# EAGLE design main (EAGLE 9.3.1)
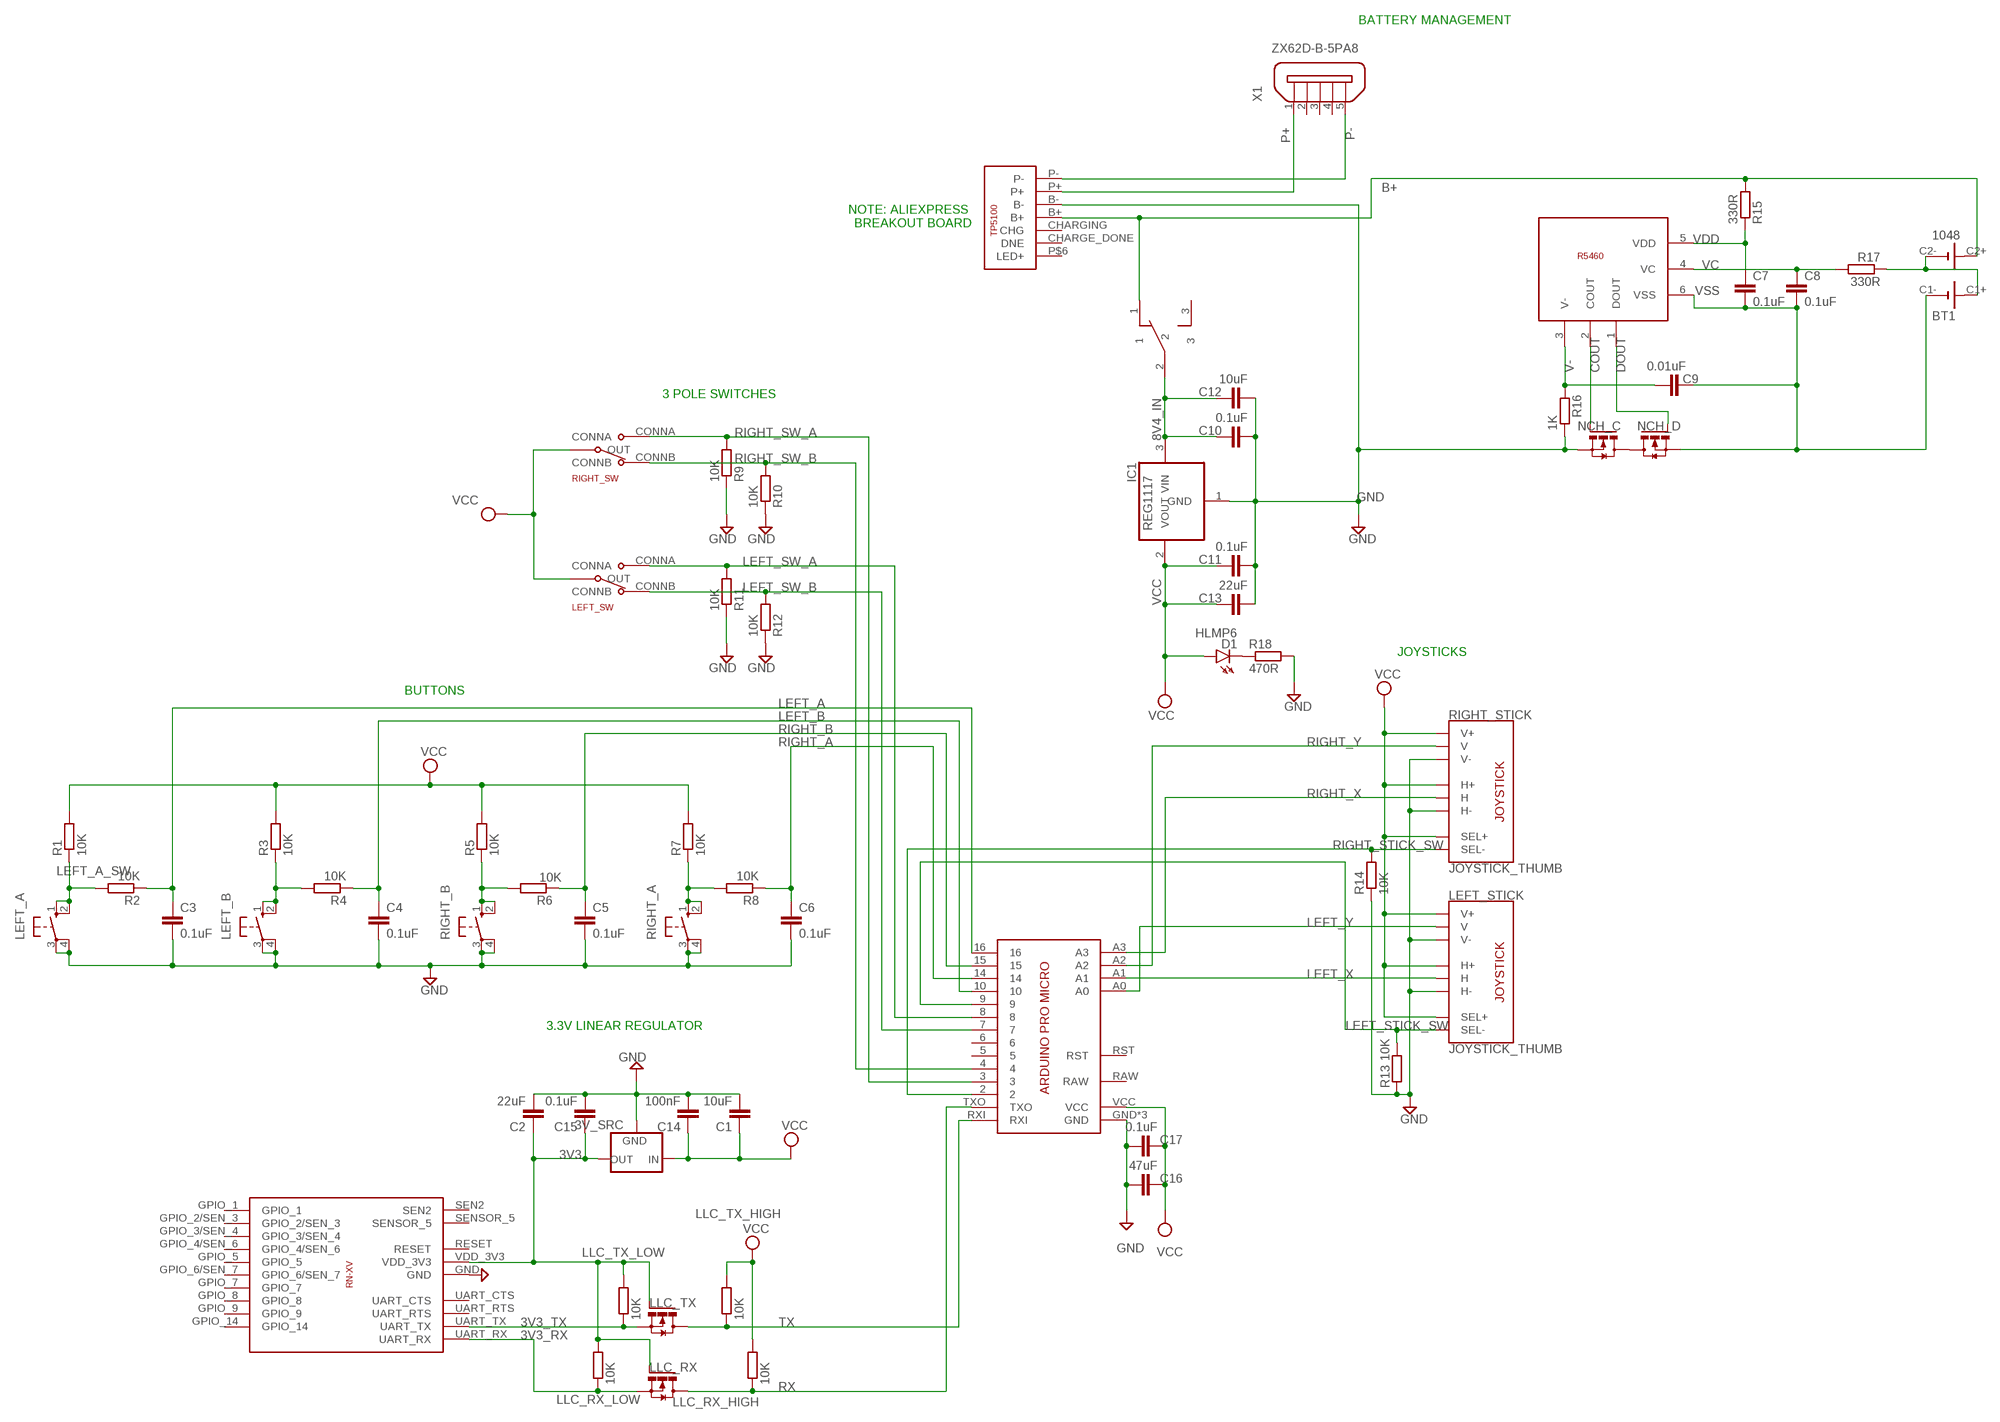
[diagram p0: schematic, sheet 1]

## Parts
3V_SRC  V_REG_LD1117VXXLD1117-SMD  [SOT223]
BT1  1048  [BAT_1048]
C1  10uF  C-EUC0805  [C0805]
C2  22uF  C-EUC0805  [C0805]
C3  0.1uF  0.1UF-0603-25V-5%  [0603]
C4  0.1uF  0.1UF-0603-25V-5%  [0603]
C5  0.1uF  0.1UF-0603-25V-5%  [0603]
C6  0.1uF  0.1UF-0603-25V-5%  [0603]
C7  0.1uF  0.1UF-0603-25V-(+80/-20%)  [0603]
C8  0.1uF  0.1UF-0603-25V-(+80/-20%)  [0603]
C9  0.01uF  0.1UF-0603-25V-(+80/-20%)  [0603]
C10  0.1uF  C-EUC0805  [C0805]
C11  0.1uF  C-EUC0805  [C0805]
C12  10uF  C-EUC0805  [C0805]
C13  22uF  C-EUC0805  [C0805]
C14  100nF  C-EUC0805  [C0805]
C15  0.1uF  C-EUC0805  [C0805]
C16  47uF  C-EUC0805  [C0805]
C17  0.1uF  C-EUC0805  [C0805]
D1  HLMP6  [HLMP6]
IC1  REG1117  [SOT223]
LEFT_A  10-XX  [B3F-10XX]
LEFT_B  10-XX  [B3F-10XX]
LEFT_STICK  JOYSTICK_THUMB  [JOYSTICK]
LEFT_SW  2_POLE_SWITCH  [2_POLE_SWITCH]
LLC_RX  2N7002,215  [SOT23-3]
LLC_RX_HIGH  10K  R  [R0805]
LLC_RX_LOW  10K  R  [R0805]
LLC_TX  2N7002,215  [SOT23-3]
LLC_TX_HIGH  10K  R  [R0805]
LLC_TX_LOW  10K  R  [R0805]
NCH_C  FQD13N06LTM  [DPAK4]
NCH_D  FQD13N06LTM  [DPAK4]
R1  10K  R  [R0805]
R2  10K  R  [R0805]
R3  10K  R  [R0805]
R4  10K  R  [R0805]
R5  10K  R  [R0805]
R6  10K  R  [R0805]
R7  10K  R  [R0805]
R8  10K  R  [R0805]
R9  10K  R  [R0805]
R10  10K  R  [R0805]
R11  10K  R  [R0805]
R12  10K  R  [R0805]
R13  10K  R  [R0805]
R14  10K  R  [R0805]
R15  330R  R  [R0805]
R16  1K  R  [R0805]
R17  330R  R  [R0805]
R18  470R  R  [R0805]
R5460  R5460  [SOT-23-6]
RIGHT_A  10-XX  [B3F-10XX]
RIGHT_B  10-XX  [B3F-10XX]
RIGHT_STICK  JOYSTICK_THUMB  [JOYSTICK]
RIGHT_SW  2_POLE_SWITCH  [2_POLE_SWITCH]
U$1  ARDUINO_PRO_MICRO  [ARDUINO_PRO_MICRO]
U$2  RN-XV  [RN-XV]
U$4  TP5100_MODULE  [TP5100_MODULE]
U$6  EG1201  [EG1201]
X1  ZX62D-B-5PA8  [ZX62D-B-5PA8]

## Nets
3V3: 3V_SRC.2(OUT) C2.1 C15.1 LLC_RX.1(G) LLC_RX_LOW.2 LLC_TX.1(G) LLC_TX_LOW.2 U$2.VDD_3V3
3V3_RX: LLC_RX.2(S) LLC_RX_LOW.1 U$2.UART_RX
3V3_TX: LLC_TX.2(S) LLC_TX_LOW.1 U$2.UART_TX
8V4_IN: C10.1 C12.1 IC1.3(VIN) U$6.2
B+: BT1.C2+ R15.2 U$4.B+ U$6.1
BM: BT1.C1+ BT1.C2- R17.1
COUT: NCH_C.1(G) R5460.2(COUT)
DOUT: NCH_D.1(G) R5460.1(DOUT)
GND: 3V_SRC.1(GND) C1.2 C2.2 C3.2 C4.2 C5.2 C6.2 C10.2 C11.2 C12.2 C13.2 C14.2 C15.2 C16.2 C17.2 IC1.1(GND) LEFT_A.3(P) LEFT_A.4(P1) LEFT_B.3(P) LEFT_B.4(P1) LEFT_STICK.H3(H-) LEFT_STICK.V3(V-) NCH_C.3(S) R9.1 R10.1 R11.1 R12.1 R13.1 R14.1 R16.1 R18.2 RIGHT_A.3(P) RIGHT_A.4(P1) RIGHT_B.3(P) RIGHT_B.4(P1) RIGHT_STICK.H3(H-) RIGHT_STICK.V3(V-) U$1.GND U$1.GND2(GND) U$1.GND3(GND) U$2.GND U$4.B-
LEFT_A: C3.1 R2.1 U$1.16
LEFT_A_SW: LEFT_A.1(S) LEFT_A.2(S1) R1.1 R2.2
LEFT_B: C4.1 R4.1 U$1.10
LEFT_B_SW: LEFT_B.1(S) LEFT_B.2(S1) R3.1 R4.2
LEFT_STICK_SW: LEFT_STICK.B2A(SEL-) R13.2 U$1.9
LEFT_SW_A: LEFT_SW.CONNA R11.2 U$1.8
LEFT_SW_B: LEFT_SW.CONNB R12.2 U$1.7
LEFT_X: LEFT_STICK.H2(H) U$1.A1
LEFT_Y: LEFT_STICK.V2(V) U$1.A0
N$3: NCH_C.2(D) NCH_C.4(D) NCH_D.2(D) NCH_D.4(D)
N$5: D1.K R18.1
P+: U$4.P+ X1.1
P-: U$4.P- X1.5
RIGHT_A: C6.1 R8.1 U$1.14
RIGHT_A_SW: R7.1 R8.2 RIGHT_A.1(S) RIGHT_A.2(S1)
RIGHT_B: C5.1 R6.1 U$1.15
RIGHT_B_SW: R5.1 R6.2 RIGHT_B.1(S) RIGHT_B.2(S1)
RIGHT_STICK_SW: R14.2 RIGHT_STICK.B2A(SEL-) U$1.2
RIGHT_SW_A: R9.2 RIGHT_SW.CONNA U$1.3
RIGHT_SW_B: R10.2 RIGHT_SW.CONNB U$1.4
RIGHT_X: RIGHT_STICK.H2(H) U$1.A3
RIGHT_Y: RIGHT_STICK.V2(V) U$1.A2
RX: LLC_RX.3(D) LLC_RX_HIGH.1 U$1.TXO
TX: LLC_TX.3(D) LLC_TX_HIGH.1 U$1.RXI
V-: C9.1 R16.2 R5460.3(V-)
VC: C8.1 R17.2 R5460.4(VC)
VCC: 3V_SRC.3(IN) C1.1 C11.1 C13.1 C14.1 C16.1 C17.1 D1.A IC1.2(VOUT) LEFT_STICK.B1A(SEL+) LEFT_STICK.H1(H+) LEFT_STICK.V1(V+) LEFT_SW.OUT LLC_RX_HIGH.2 LLC_TX_HIGH.2 R1.2 R3.2 R5.2 R7.2 RIGHT_STICK.B1A(SEL+) RIGHT_STICK.H1(H+) RIGHT_STICK.V1(V+) RIGHT_SW.OUT U$1.VCC
VDD: C7.1 R15.1 R5460.5(VDD)
VSS: BT1.C1- C7.2 C8.2 C9.2 NCH_D.3(S) R5460.6(VSS)
Unconnected: U$1.5 U$1.6 U$1.RAW U$1.RST U$2.GPIO_1 U$2.GPIO_2/SEN_3 U$2.GPIO_3/SEN_4 U$2.GPIO_4/SEN_6 U$2.GPIO_5 U$2.GPIO_6/SEN_7 U$2.GPIO_7 U$2.GPIO_8 U$2.GPIO_9 U$2.GPIO_14 U$2.RESET U$2.SEN2 U$2.SENSOR_5 U$2.UART_CTS U$2.UART_RTS U$4.CHARGE_DONE(DNE) U$4.CHARGING(CHG) U$4.P$6(LED+) U$6.3 X1.2 X1.3 X1.4 X1.S1 X1.S2 X1.S3 X1.S4

## Notes on the sheet
- BATTERY MANAGEMENT
- NOTE: ALIEXPRESS 
  BREAKOUT BOARD
- 3 POLE SWITCHES
- JOYSTICKS
- BUTTONS
- 3.3V LINEAR REGULATOR

## Library data of the parts
3V_SRC = CUSTOM-SparkFun-IC-Power:V_REG_LD1117VXX: LD1117VXX voltage regulator. We carry the 3.3V version (COM-00526) in TO-220 package.; PROD_ID: VREG-13917
BT1 = 1048:1048: Lithium-Ion Battery Holder, 2 Cell, Plastic UL 94V-O, SMT; AVAILABILITY: Unavailable; DESCRIPTION: Grip, Pump Handle; MF: Adafruit Industries; MP: 1048; PACKAGE: None; PRICE: None
C1 C2 C10-C17 = rcl:C-EU: CAPACITOR, European symbol; SPICEPREFIX: C
C3-C6 = SparkFun-Capacitors:0.1UF: 0.1µF ceramic capacitors A capacitor is a passive two-terminal electrical component used to store electrical energy temporarily in an electric field.; PROD_ID: CAP-08604
C7 C8 = SparkFun-Capacitors:0.1UF: 0.1µF ceramic capacitors A capacitor is a passive two-terminal electrical component used to store electrical energy temporarily in an electric field.; PROD_ID: CAP-00810
C9 = SparkFun-Capacitors:0.1UF: 0.1µF ceramic capacitors A capacitor is a passive two-terminal electrical component used to store electrical energy temporarily in an electric field.; PROD_ID: CAP-00810; VALUE: 0.1uF
D1 = display-hp:HLMP6: LED 2mm horizontal; MF: AGILENT TECHNOLOGIES; MPN: HLMP-6500; OC_FARNELL: 1652490; OC_NEWARK: 40K0088
IC1 = burr-brown:REG1117: 800mA and 1A Low Dropout (LDO) Positive Regulator 1.8V, 2.5V, 2.85V, 3.3V, 5V, and Adj; MPN: REG1117; OC_FARNELL: 1097566; OC_NEWARK: 14P6981
LEFT_A LEFT_B RIGHT_A RIGHT_B = switch-omron:10-XX: OMRON SWITCH; MPN: B3F-1000; OC_FARNELL: 176432; OC_NEWARK: 36M3542
LEFT_STICK RIGHT_STICK = SparkFun-Switches:JOYSTICK_THUMB: Analog Thumb Joystick This is a joystick very similar to the ‘analog’ joysticks on PS2 (PlayStation 2) controllers. Directional movements are simply two potentiometers - one for each axis. Pots are ~10k each. This joystick also has a select button that is actuated when the joystick is pressed down. SparkFun Products Thumb Joystick <https://www.sparkfun.com/products/9032> (COM-09032) SparkFun Thumb Joystick Breakout <https://www.sparkfun.com/products/9110> (BOB-09110) SparkFun Joystick Shield Kit <https://www.sparkfun.com/products/9760> (DEV-09760); PROD_ID: COMP-09744; SF_SKU: COM-09032
LEFT_SW RIGHT_SW = CustomParts:2_POLE_SWITCH
LLC_RX LLC_TX = Transistor:2N7002,215: MOSFET N-CH 60V 300MA SOT-23 Manufacturer's datasheet <https://assets.nexperia.com/documents/data-sheet/2N7002.pdf>; CREATED_BY: PCBLayout.com; DIGIKEY_PART_NUMBER: 1727-2764-1-ND; MANUFACTURER: Nexperia USA Inc.; MPN: 2N7002,215; PACKAGE: SOT-23-3
LLC_RX_HIGH LLC_RX_LOW LLC_TX_HIGH LLC_TX_LOW R1-R18 = eagle-ltspice:R: RESISTOR, European symbol; SPICEMODEL: NONE; SPICEPREFIX: R
NCH_C NCH_D = Transistor:FQD13N06LTM: MOSFET N-CH 60V 11A DPAK Manufacturer's datasheet <https://www.onsemi.com/pub/Collateral/FQU13N06L-D.PDF>; CREATED_BY: PCBLayout.com; DIGIKEY_PART_NUMBER: FQD13N06LTMCT-ND; MANUFACTURER: ON Semiconductor; MPN: FQD13N06LTM; PACKAGE: DPAK-4
R5460 = CustomParts:R5460
U$1 = arduino:ARDUINO_PRO_MICRO: Arduino Pro Micro Pin headers for Arduino Pro Micro board from SparkFun
U$2 = CustomParts:RN-XV
U$4 = CustomParts:TP5100_MODULE
U$6 = CustomParts:EG1201
X1 = zx62d-b-5pa8-oshpark_10:ZX62D-B-5PA8: Micro USB Type B Connector - Standard, Shell Through Hole Source: http://www.hirose.co.jp/cataloge_hp/ed_ZX_20140804.pdf; MF: Hirose; MPN: ZX62D-B-5PA8; OC_FARNELL: 2300438; OC_NEWARK: 69W0712

## Board
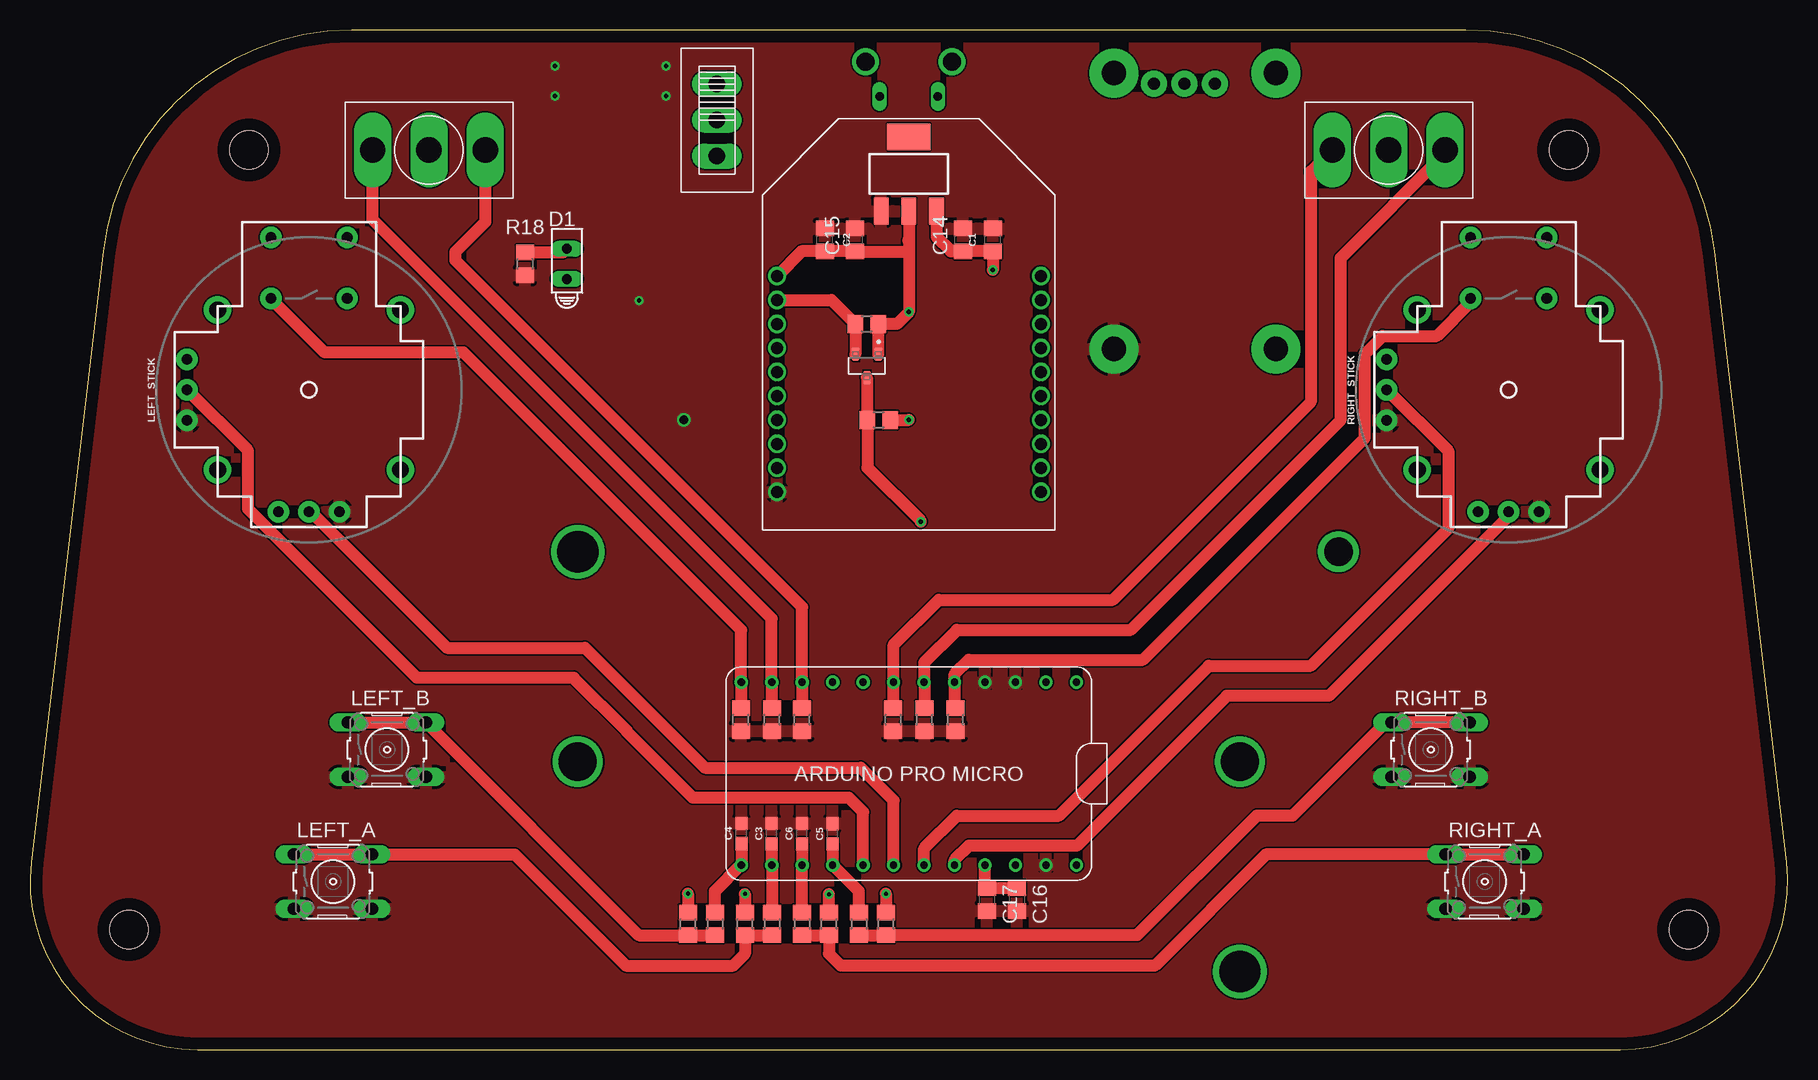
[diagram p1: board, top side]
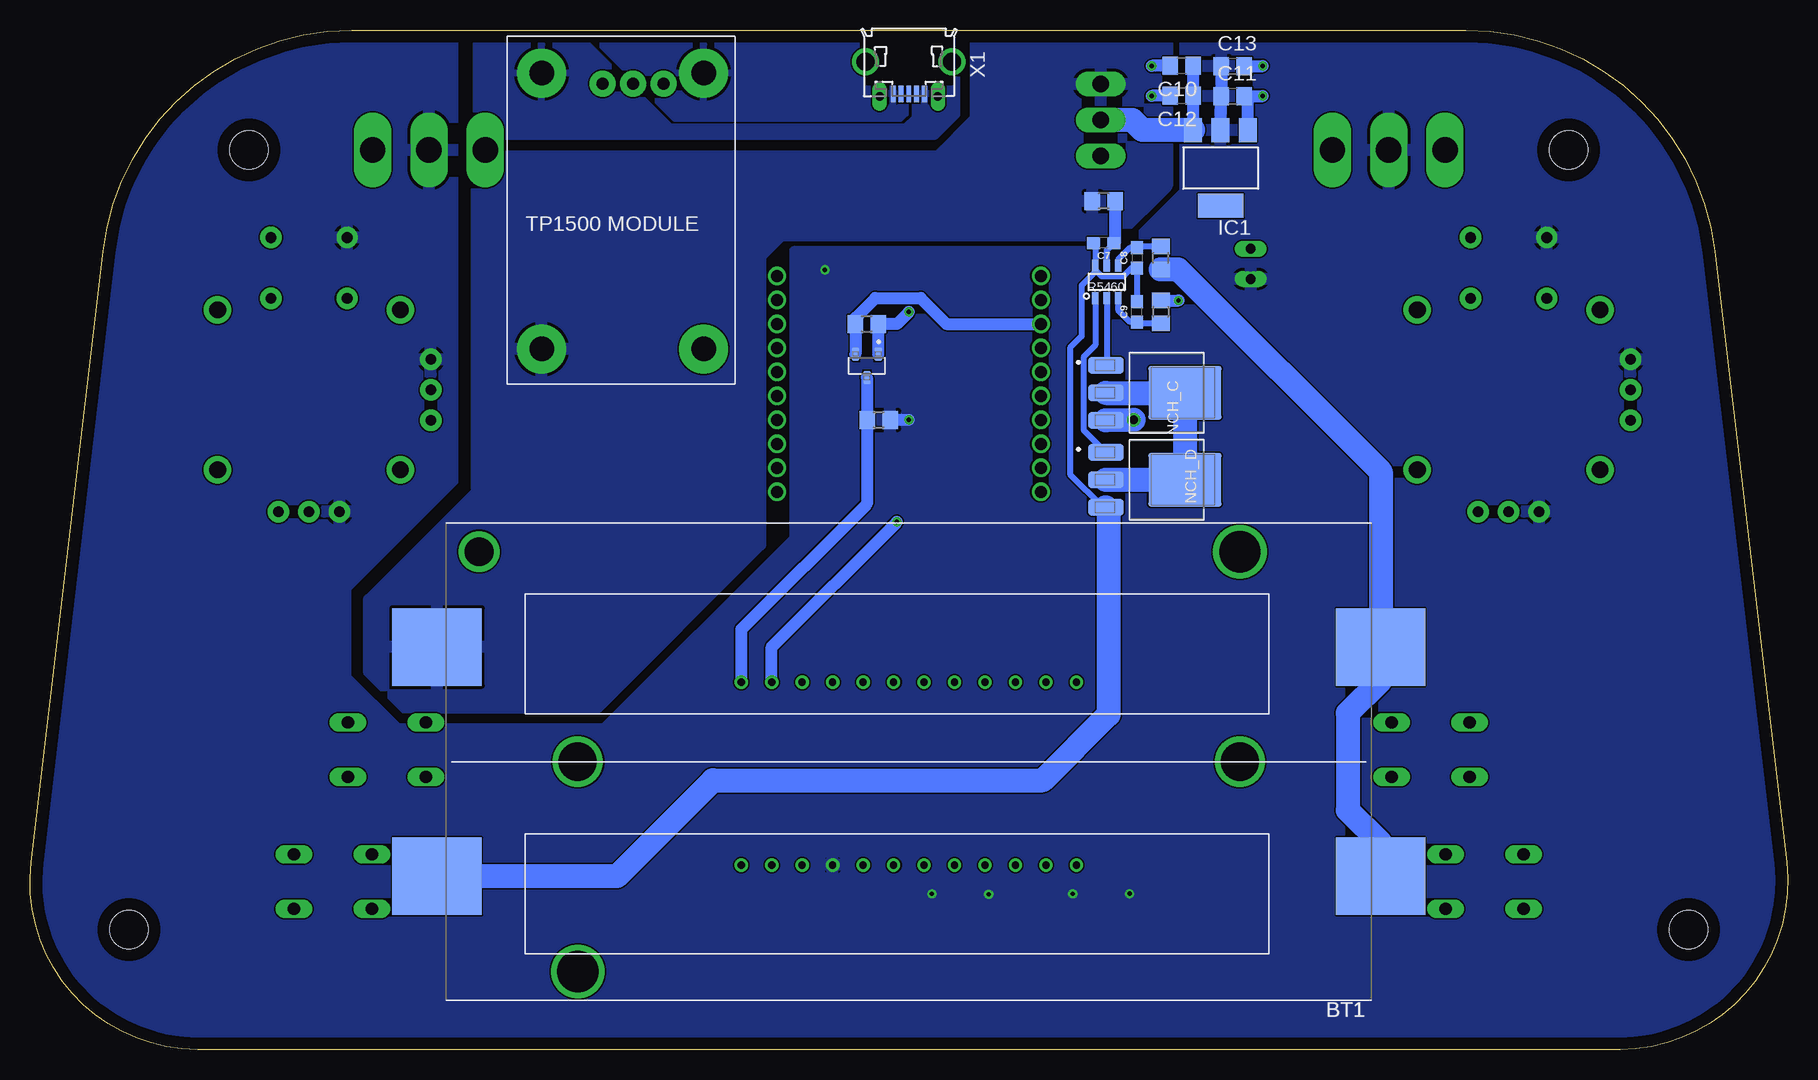
[diagram p2: board, bottom side, seen from below]

Size 146.51 x 85 mm. Coordinates in mm from the lower left corner, seen from the top.
Outline: 13.97,0 132.55,0 arc97 146.42,15.6 140.42,66.58 arc83 119.71,85 26.81,85 arc83 6.09,66.58 0.09,15.6 arc97 13.97,0
Copper layers (1*16): Top 0.035mm / dielectric 1.5mm / Bottom 0.035mm
Design rules "jlc": minimum track width 5mil, minimum drill 0.3mm, track to track 5mil, track to pad 5mil, pad to pad 5mil, via to via 5mil, smd to smd 5mil, copper to edge 40mil, drill to drill 0.25mm, minimum pad ring 10mil, minimum via ring 8mil, stop-mask expansion 4mil, vias tented up to drill 0mil, thermal gap 10mil
Holes 3.2 mm at 8.26,10 138.26,10 128.26,75 18.26,75

### Footprints (pad centres in the part's own frame; a part is rotated, then mirrored left to right if it is on the bottom)
SOT223 = smd 1.219 x 2.235: 1 -2.311,-3.099; 2 0,-3.099; 3 2.311,-3.099 | smd 3.6 x 2.2: 4 0,3.099
BAT_1048 = smd 7.45 x 6.45: C1+ -39.33,9.555; C1- 39.33,9.555; C2+ 39.33,-9.555; C2- -39.33,-9.555 | drill 3.17: P$1 27.6,0; P$2 -27.6,0 | drill 3.45: P$3 -27.6,-17.505; P$4 27.6,17.505 | drill 2.39: P$5 35.82,-17.505
C0805 = smd 1.3 x 1.5: 1 -0.95,0; 2 0.95,0
0603 = smd 1.1 x 1: 1 -0.85,0; 2 0.85,0
HLMP6 = drill 0.813 long: A -1.27,0; K 1.27,0
SOT223' = smd 1.499 x 2.007: 1 -2.261,-3.15; 2 0.025,-3.15; 3 2.311,-3.15 | smd 3.81 x 2.007: 4 0,3.15
B3F-10XX = drill 1.016 long: 1 -3.251,2.261; 2 3.251,2.261; 3 -3.251,-2.261; 4 3.251,-2.261
JOYSTICK = drill 0.9 pad 1.778: B1A -3.175,12.7; B1B 3.175,12.7; B2A -3.175,7.62; B2B 3.175,7.62 | drill 0.889 pad 1.778: H1 -2.54,-10.16; H2 0,-10.16; H3 2.54,-10.16; V1 -10.16,2.54; V2 -10.16,0; V3 -10.16,-2.54 | drill 1.397 pad 2.286: MOUNT1 -7.62,6.668; MOUNT2 -7.62,-6.668; MOUNT3 7.62,-6.668; MOUNT4 7.62,6.668
2_POLE_SWITCH = drill 2.1 pad 2.8 long: CONNA 0,-4.7; CONNB 0,4.7; OUT 0,0
SOT23-3 = smd 0.62 x 1.1: 1 -0.95,-0.975; 2 0.95,-0.975; 3 0,0.975
R0805 = smd 1.3 x 1.5: 1 -0.95,0; 2 0.95,0
DPAK4 = smd 1.36 x 2.98: 1 -2.29,-4.07; 2 0,-4.07; 3 2.29,-4.07 | smd 4.49 x 6.1: 4 0,2.51
SOT-23-6 = smd 1 x 0.55: 1 -1.35,0.95; 2 -1.35,0; 3 -1.35,-0.95; 4 1.35,-0.95; 5 1.35,0; 6 1.35,0.95
ARDUINO_PRO_MICRO = drill 0.6: 2 -7.62,3.81; 3 -7.62,1.27; 4 -7.62,-1.27; 5 -7.62,-3.81; 6 -7.62,-6.35; 7 -7.62,-8.89; 8 -7.62,-11.43; 9 -7.62,-13.97; 10 7.62,-13.97; 14 7.62,-8.89; 15 7.62,-6.35; 16 7.62,-11.43; A0 7.62,-3.81; A1 7.62,-1.27; A2 7.62,1.27; A3 7.62,3.81; GND -7.62,8.89; GND2 -7.62,6.35; GND3 7.62,11.43; RAW 7.62,13.97; RST 7.62,8.89; RXI -7.62,11.43; TXO -7.62,13.97; VCC 7.62,6.35
RN-XV = drill 1: GND -9,10.998; GPIO_1 -7,10.998; GPIO_2/SEN_3 7,-10.998; GPIO_3/SEN_4 5,-10.998; GPIO_4/SEN_6 -5,-10.998; GPIO_5 -1,10.998; GPIO_6/SEN_7 -1,-10.998; GPIO_7 -3,10.998; GPIO_8 3,10.998; GPIO_9 -5,10.998; GPIO_14 -9,-10.998; NC -3,-10.998; RESET 1,10.998; SEN2 9,-10.998; SENSOR_5 3,-10.998; UART_CTS 1,-10.998; UART_RTS -7,-10.998; UART_RX 5,10.998; UART_TX 7,10.998; VDD_3V3 9,10.998
TP5100_MODULE = drill 2.032 pad 4.064: B+ 7.101,11.098; B- -6.399,11.098; P+ 7.101,-11.902; P- -6.399,-11.902 | drill 1.016 pad 2.184: CHARGE_DONE 2.021,-11.012; CHARGING -3.059,-11.012; P$6 -0.519,-11.012
EG1201 = drill 1.4 long: 1 -3,0; 2 0,0; 3 3,0
ZX62D-B-5PA8 = smd 1.35 x 0.4: 1 4.825,1.3; 2 4.825,0.65; 3 4.825,0; 4 4.825,-0.65; 5 4.825,-1.3 | drill 1.5: S1 2.15,-3.6; S2 2.15,3.6 | drill 0.7 long: S3 5.05,2.425; S4 5.05,-2.425

### Placement (x,y rotation side)
3V_SRC  73.26,73 0 top
BT1  73.26,24 180 bottom
C1  80.26,67.5 90 top
C2  66.26,67.5 90 top
C3  61.83,18 90 top
C4  59.29,18.02 90 top
C5  66.89,17.98 90 top
C6  64.35,18.01 90 top
C7  57.01,67.25 180 bottom
C8  54.26,66 270 bottom
C9  54.26,61.5 90 bottom
C10  50.51,82 180 bottom
C11  46.26,79.5 0 bottom
C12  50.51,79.5 180 bottom
C13  46.26,82 0 bottom
C14  77.76,67.5 90 top
C15  68.76,67.5 90 top
C16  82.26,12.5 270 top
C17  79.76,12.5 270 top
D1  44.76,65.5 90 top
IC1  REG1117  [SOT223']  47.26,73.5 180 bottom
LEFT_A  25.26,14 0 top
LEFT_B  29.76,25 0 top
LEFT_STICK  23.26,55 0 top
LEFT_SW  33.26,75 270 top
LLC_RX  76.76,57 180 bottom
LLC_RX_HIGH  75.76,52.5 0 bottom
LLC_RX_LOW  76.76,60.5 0 bottom
LLC_TX  69.76,57 180 top
LLC_TX_HIGH  70.76,52.5 0 top
LLC_TX_LOW  69.76,60.5 0 top
NCH_C  52.76,54.75 270 bottom
NCH_D  52.76,47.5 270 bottom
R1  59.6,10.48 90 top
R2  61.85,10.48 270 top
R3  54.85,10.48 90 top
R4  57.1,10.48 270 top
R5  71.35,10.48 90 top
R6  69.1,10.48 270 top
R7  66.6,10.48 90 top
R8  64.35,10.48 270 top
R9  74.56,27.5 90 top
R10  71.96,27.5 90 top
R11  61.86,27.5 90 top
R12  64.36,27.5 90 top
R13  59.26,27.5 90 top
R14  77.16,27.5 90 top
R15  57.01,70.75 180 bottom
R16  52.26,61.5 270 bottom
R17  52.26,66 90 bottom
R18  41.26,65.5 270 top
R5460  56.76,64 90 bottom
RIGHT_A  121.26,14 0 top
RIGHT_B  116.76,25 0 top
RIGHT_STICK  123.26,55 0 top
RIGHT_SW  113.26,75 90 top
U$1  73.26,23 270 top
U$2  73.26,55.5 90 top
U$4  96.76,69.5 180 bottom
U$6  57.26,77.5 270 top
X1  73.26,84.5 270 bottom

### Tracks (layer width: path | path; a pad name or v marks a point on that pad's centre or on a via)
3V3  (via drill 0.35)
  Top 1: LLC_TX.1 LLC_TX_LOW.2 72.26,60.5 v73.26,61.5 73.26,66.5 | 3V_SRC.2 73.26,67.5 | 73.26,67.5 73.26,66.5 | 73.26,67.5 73.21,67.45 | 73.26,66.5 68.81,66.5 C15.1 C2.1 64.31,66.55 U$2.VDD_3V3
  Bottom 1: LLC_RX.1 LLC_RX_LOW.2 74.26,60.5 v73.26,61.5
3V3_RX
  Bottom 1: LLC_RX.2 LLC_RX_LOW.1 77.71,61 76.05,62.65 72.28,62.65 70.13,60.5 U$2.UART_RX
3V3_TX
  Top 1: LLC_TX.2 LLC_TX_LOW.1 66.81,62.5 U$2.UART_TX
8V4_IN
  Bottom 1: C10.1 C12.1 IC1.3
  Bottom 2: IC1.3 53.78,76.65 54.63,77.5 U$6.2
B+
  pour Bottom: 51.76,88.5 51.76,72 55.92,67.83 83.92,67.83 85.65,66.1 85.65,42.1 99.26,28.5 115.26,28.5 118.26,31.5 118.26,37.5 109.26,46.5 109.26,74.5 70.76,74.5 67.66,77.6 67.66,88.5
BM
  Bottom 1: R17.1 52.21,65
  Bottom 2: BT1.C1+ 33.93,17.23 36.66,19.96 36.66,28.04 33.93,30.77 BT1.C2- 33.93,48.17 50.81,65.05 R17.1
COUT
  Bottom 0.5: R5460.2 56.76,57.11 NCH_C.1
DOUT
  Bottom 0.5: R5460.1 57.71,58.72 58.69,57.73 58.69,51.66 NCH_D.1
GND  (via drill 0.35, 0.7)
  Bottom 1: R16.1 v50.78,62.45 | C13.2 v43.76,82 | v43.76,79.5 C11.2 45,79.19 IC1.1 | C10.2 v53.01,82 | C12.2 v53.01,79.5
  Bottom 2: NCH_C.3 56.83,52.48 56.81,52.46 54.52,52.51 v54.51,52.49
  pour Top: -1.89,0.46 8.17,85.52 138.05,86.01 148.62,-3.03
LEFT_A
  Top 1: R2.1 61.85,15.36 U$1.16 C3.1
LEFT_A_SW
  Top 1: LEFT_A.1 LEFT_A.2 40.41,16.26 49.67,7 58.61,7 59.6,7.99 R1.1 R2.2
LEFT_B
  Top 1: R4.1 57.1,13.19 U$1.10 C4.1
LEFT_B_SW
  Top 1: LEFT_B.1 LEFT_B.2 50.74,9.53 R3.1 R4.2
LEFT_STICK_SW
  Top 1: R13.2 59.29,28.48 U$1.9 59.29,34.97 36.14,58.12 24.58,58.12 LEFT_STICK.B2A
LEFT_SW_A
  Top 1: R11.2 61.83,28.48 U$1.8 61.83,35.93 28.56,69.2 LEFT_SW.CONNA
LEFT_SW_B
  Top 1: R12.2 U$1.7 64.37,36.89 35.46,65.8 35.46,66.5 37.96,69 LEFT_SW.CONNB
LEFT_X
  Top 1: LEFT_STICK.H2 23.42,44.84 34.76,33.5 46.26,33.5 56.26,23.5 69.26,23.5 71.99,20.77 U$1.A1
LEFT_Y
  Top 1: U$1.A0 69.45,19.81 68.26,21 55.26,21 49.76,26.5 49.76,26.57 45.33,31 32.26,31 18.18,45.08 18.18,49.92 LEFT_STICK.V2
N$3
  Bottom 2: NCH_C.2 NCH_C.4 NCH_D.4 NCH_D.2
N$5
  Top 1: D1.K 44.44,66.45 R18.1
P+
  pour Bottom: 72.76,84.5 72.76,77.71 73.58,76.88 93.14,76.88 100.76,84.5 109.34,84.5 109.34,76.67 108.83,76.15 71.03,76.15 69.26,77.92 69.26,84.5
P-
  pour Bottom: 92.77,77.64 73.95,77.64 73.53,78.06 73.53,85.95 101.08,85.95
RIGHT_A
  Top 1: R8.1 64.35,15.36 | 64.35,15.36 U$1.14 | C6.1 64.35,15.36
RIGHT_A_SW
  Top 1: RIGHT_A.2 RIGHT_A.1 103.02,16.26 93.76,7 67.59,7 66.6,7.99 R7.1 R8.2
RIGHT_B
  Top 1: R6.1 69.1,13.19 U$1.15 C5.1
RIGHT_B_SW
  Top 1: RIGHT_B.2 RIGHT_B.1 113.01,27.26 105.24,19.5 102.26,19.5 92.28,9.53 R5.1 R6.2
RIGHT_STICK_SW
  Top 1: R14.2 77.07,28.54 U$1.2 77.07,31.31 78.26,32.5 92.76,32.5 111.26,51 111.26,58 112.76,59.5 117.26,59.5 120.08,62.33 RIGHT_STICK.B2A
RIGHT_SW_A
  Top 1: R9.2 74.56,30.59 U$1.3 74.53,32.27 77.26,35 91.76,35 109.26,52.5 109.26,66 117.96,74.7 RIGHT_SW.CONNA
RIGHT_SW_B
  Top 1: R10.2 71.96,30.59 U$1.4 71.99,33.73 75.76,37.5 90.26,37.5 106.76,54 106.76,73.2 RIGHT_SW.CONNB
RIGHT_X
  Top 1: RIGHT_STICK.H2 123.26,44.5 108.26,29.5 99.76,29.5 87.26,17 78.26,17 77.07,15.81 U$1.A3
RIGHT_Y
  Top 1: U$1.A2 74.53,16.77 77.26,19.5 85.76,19.5 98.26,32 106.76,32 118.26,43.5 118.26,49.84 RIGHT_STICK.V2
RX
  Bottom 1: LLC_RX.3 76.76,52.51 LLC_RX_HIGH.1 76.76,52.45 76.76,45.5 87.23,35.03 U$1.TXO
TX  (via drill 0.35)
  Top 1: LLC_TX.3 69.76,52.51 LLC_TX_HIGH.1 69.81,48.5 74.26,44.05 v74.26,44
  Bottom 1: U$1.RXI 84.69,33.57 v74.26,44
V-
  Bottom 0.5: R5460.3 55.81,61.65 54.81,60.65 C9.1 54.16,60.55 R16.2
VC
  Bottom 0.5: R17.2 54.16,66.95 C8.1 54.81,66.85 55.81,65.85 R5460.4
VCC  (via drill 0.35)
  Top 1: LLC_TX_HIGH.2 v73.26,52.5 | v54.85,12.99 R3.2 | v59.6,12.97 R1.2 | R7.2 v66.6,12.95 | R5.2 v71.34,12.98 | C16.1 C17.1 79.61,13.6 U$1.VCC | 3V_SRC.3 75.57,67.74 76.76,66.55 C14.1 C1.1 v80.26,65
  Bottom 1: v73.26,52.5 LLC_RX_HIGH.2 | C13.1 C11.1 47.28,79.42 IC1.2
  pour Bottom: 50.26,87.5 50.26,71.5 55.26,66.5 82.76,66.5 82.76,42.57 98.66,26.67 115.92,26.67 120.2,30.95 120.2,38.52 111.28,47.44 111.28,89.52 112.26,90.5 150.26,90.5 150.26,-6.5 144.26,-12.5 5.26,-12.5 -8.74,1.5 -8.74,75.5 11.26,95.5 42.26,95.5
VDD
  Bottom 0.5: 56.06,67.35 C7.1 56.76,66.65 R5460.5
  Bottom 1: R15.1 56.06,67.35
VSS
  Bottom 0.5: C7.2 57.71,67.25 R5460.6 | R5460.6 57.71,64.99 57.19,64.47 55.38,64.47 54.7,65.15 C8.2 C9.2 | R5460.6 57.71,64.85 58.86,63.7 58.86,59.46 59.82,58.5 59.82,47.94 57.09,45.21 NCH_D.3
  Bottom 2: BT1.C1- 97.59,14.45 89.59,22.45 62.08,22.45 56.61,27.92 56.61,44.99 NCH_D.3